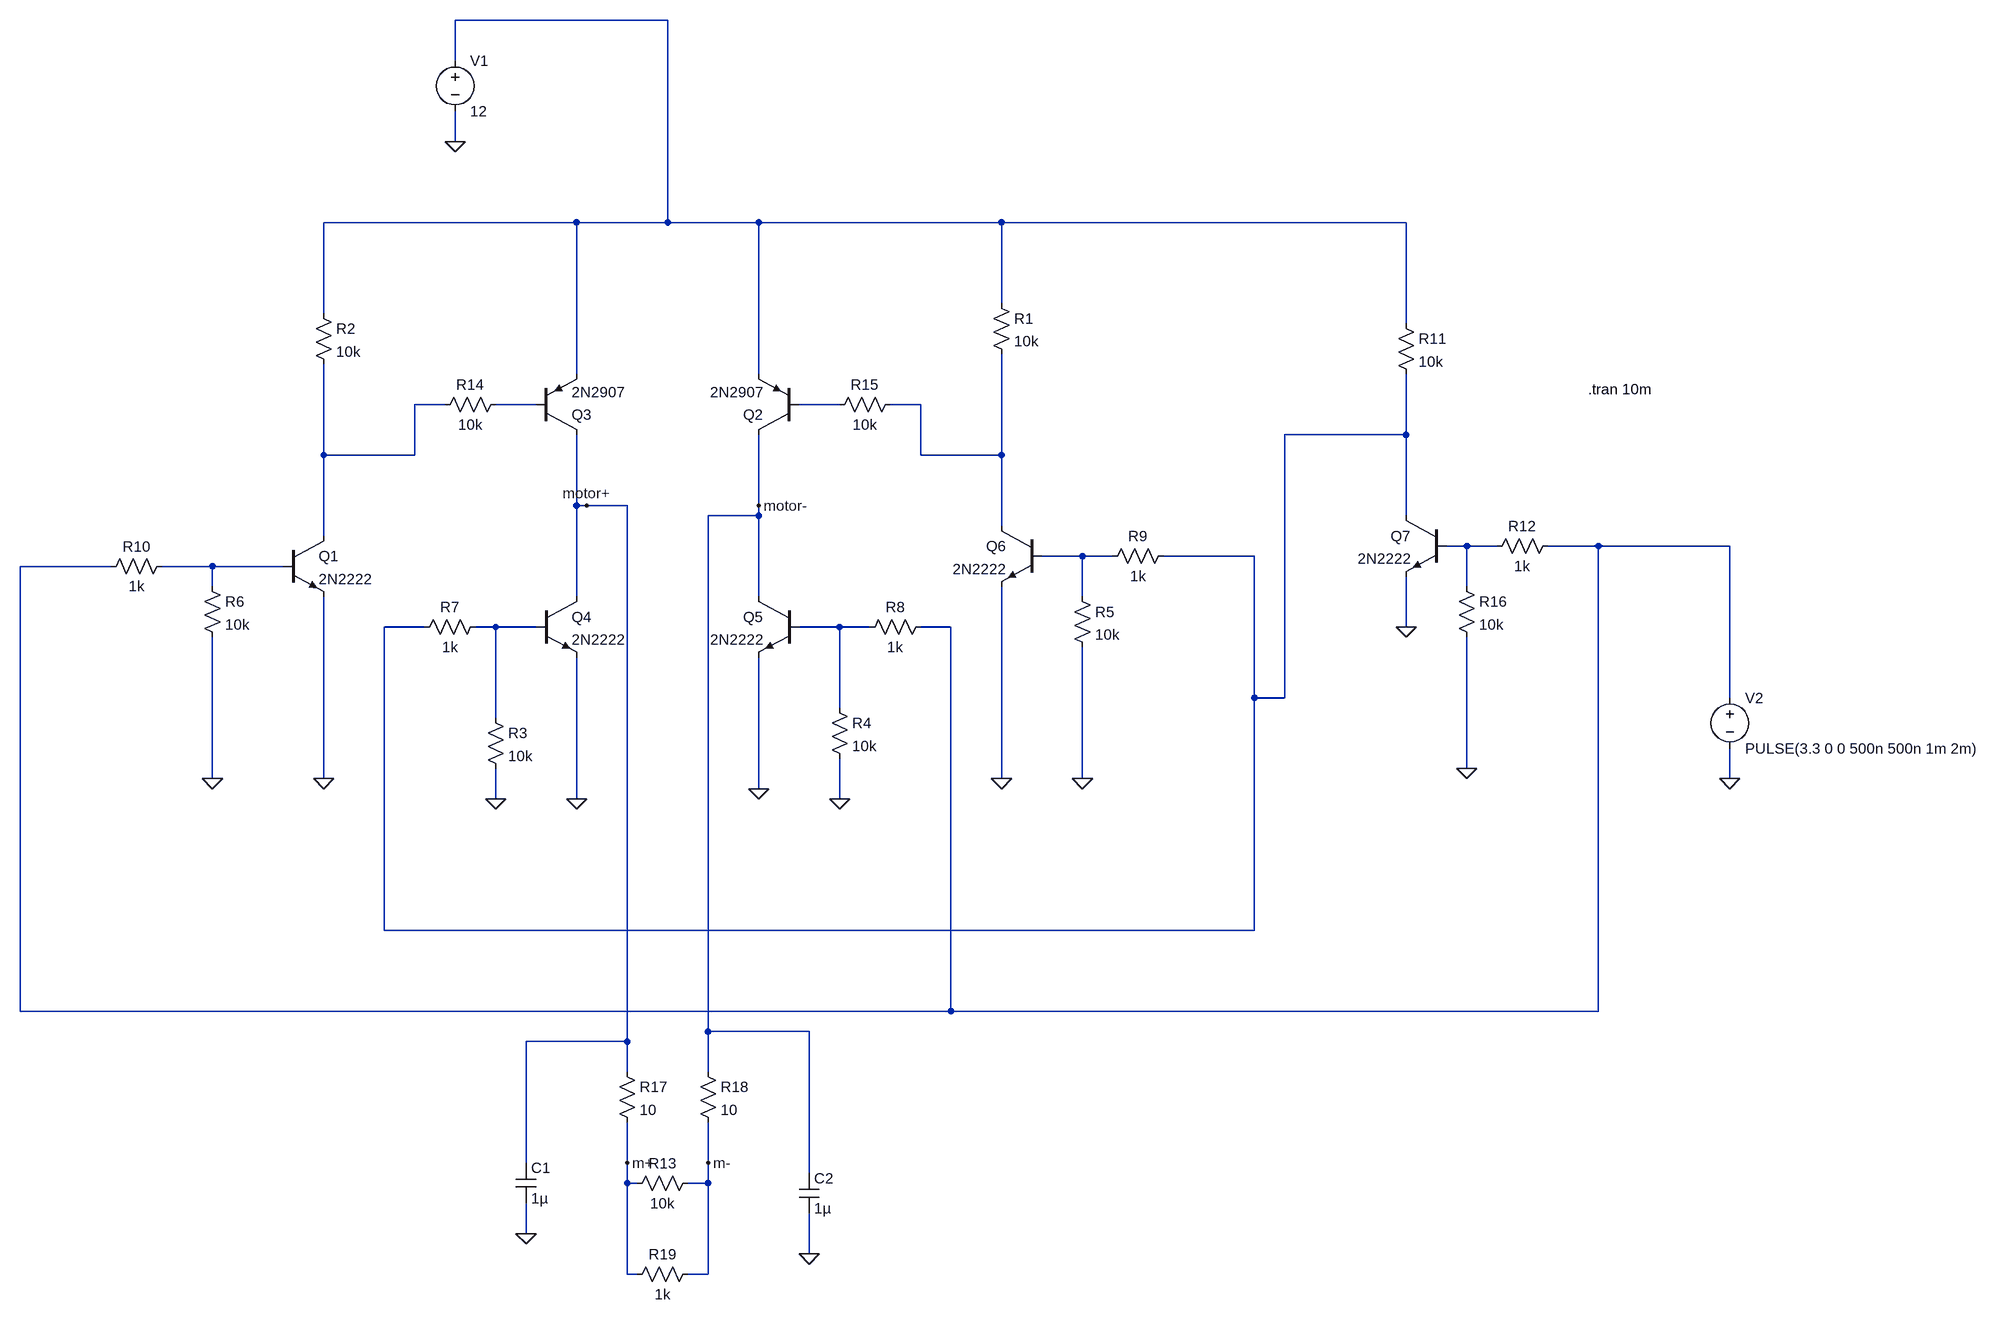
[diagram p0: schematic StallMotor.asc]
StallMotor.asc, the LTspice schematic file:
Version 4
SHEET 1 2340 1592
WIRE 256 -432 -80 -432
WIRE -80 -368 -80 -432
WIRE -80 -240 -80 -288
WIRE 112 -112 -288 -112
WIRE 256 -112 256 -432
WIRE 256 -112 112 -112
WIRE 400 -112 256 -112
WIRE 784 -112 400 -112
WIRE 1424 -112 784 -112
WIRE 784 16 784 -112
WIRE -288 32 -288 -112
WIRE 1424 48 1424 -112
WIRE 112 128 112 -112
WIRE 400 128 400 -112
WIRE -96 176 -144 176
WIRE 48 176 -16 176
WIRE 528 176 464 176
WIRE 656 176 608 176
WIRE 1424 224 1424 128
WIRE 1424 224 1232 224
WIRE -288 256 -288 112
WIRE -144 256 -144 176
WIRE -144 256 -288 256
WIRE 656 256 656 176
WIRE 784 256 784 96
WIRE 784 256 656 256
WIRE 112 336 112 224
WIRE 128 336 112 336
WIRE 192 336 128 336
WIRE 400 336 400 224
WIRE 400 352 400 336
WIRE 400 352 320 352
WIRE 1424 352 1424 224
WIRE 784 368 784 256
WIRE -288 384 -288 256
WIRE 1520 400 1488 400
WIRE 1568 400 1520 400
WIRE 1728 400 1648 400
WIRE 1936 400 1728 400
WIRE 912 416 848 416
WIRE 960 416 912 416
WIRE 1184 416 1040 416
WIRE -624 432 -768 432
WIRE -464 432 -544 432
WIRE -352 432 -464 432
WIRE -464 464 -464 432
WIRE 1520 464 1520 400
WIRE 112 480 112 336
WIRE 400 480 400 352
WIRE 912 480 912 416
WIRE -128 528 -192 528
WIRE -16 528 -48 528
WIRE 48 528 -16 528
WIRE 528 528 464 528
WIRE 576 528 528 528
WIRE 704 528 656 528
WIRE 1424 528 1424 448
WIRE 1184 640 1184 416
WIRE 1232 640 1232 224
WIRE 1232 640 1184 640
WIRE 1936 640 1936 400
WIRE 528 656 528 528
WIRE -16 672 -16 528
WIRE 1520 752 1520 544
WIRE -464 768 -464 544
WIRE -288 768 -288 480
WIRE 784 768 784 464
WIRE 912 768 912 560
WIRE 1936 768 1936 720
WIRE 400 784 400 576
WIRE -16 800 -16 752
WIRE 112 800 112 576
WIRE 528 800 528 736
WIRE -192 1008 -192 528
WIRE 1184 1008 1184 640
WIRE 1184 1008 -192 1008
WIRE -768 1136 -768 432
WIRE 704 1136 704 528
WIRE 704 1136 -768 1136
WIRE 1728 1136 1728 400
WIRE 1728 1136 704 1136
WIRE 320 1168 320 352
WIRE 480 1168 320 1168
WIRE 192 1184 192 336
WIRE 192 1184 32 1184
WIRE 192 1232 192 1184
WIRE 320 1232 320 1168
WIRE 32 1376 32 1184
WIRE 192 1376 192 1312
WIRE 320 1376 320 1312
WIRE 480 1392 480 1168
WIRE 192 1408 192 1376
WIRE 208 1408 192 1408
WIRE 320 1408 320 1376
WIRE 320 1408 288 1408
WIRE 32 1488 32 1440
WIRE 480 1520 480 1456
WIRE 192 1552 192 1408
WIRE 208 1552 192 1552
WIRE 320 1552 320 1408
WIRE 320 1552 288 1552
FLAG -288 768 0
FLAG 784 768 0
FLAG 912 768 0
FLAG -464 768 0
FLAG -16 800 0
FLAG 528 800 0
FLAG 112 800 0
FLAG 400 784 0
FLAG -80 -240 0
FLAG 1424 528 0
FLAG 1936 768 0
FLAG 128 336 motor+
FLAG 400 336 motor-
FLAG 1520 752 0
FLAG 192 1376 m+
FLAG 320 1376 m-
FLAG 32 1488 0
FLAG 480 1520 0
SYMBOL npn -352 384 R0
SYMATTR InstName Q1
SYMATTR Value 2N2222
SYMBOL pnp 464 224 R180
SYMATTR InstName Q2
SYMATTR Value 2N2907
SYMBOL pnp 48 224 M180
SYMATTR InstName Q3
SYMATTR Value 2N2907
SYMBOL npn 48 480 R0
SYMATTR InstName Q4
SYMATTR Value 2N2222
SYMBOL npn 464 480 M0
SYMATTR InstName Q5
SYMATTR Value 2N2222
SYMBOL npn 848 368 M0
SYMATTR InstName Q6
SYMATTR Value 2N2222
SYMBOL Res 768 0 R0
SYMATTR InstName R1
SYMATTR Value 10k
SYMBOL Res -304 16 R0
SYMATTR InstName R2
SYMATTR Value 10k
SYMBOL Res -32 656 R0
SYMATTR InstName R3
SYMATTR Value 10k
SYMBOL Res 512 640 R0
SYMATTR InstName R4
SYMATTR Value 10k
SYMBOL Res 896 464 R0
SYMATTR InstName R5
SYMATTR Value 10k
SYMBOL Res -480 448 R0
SYMATTR InstName R6
SYMATTR Value 10k
SYMBOL Res -32 512 R90
WINDOW 0 0 56 VBottom 2
WINDOW 3 32 56 VTop 2
SYMATTR InstName R7
SYMATTR Value 1k
SYMBOL Res 672 512 R90
WINDOW 0 0 56 VBottom 2
WINDOW 3 32 56 VTop 2
SYMATTR InstName R8
SYMATTR Value 1k
SYMBOL Res 1056 400 R90
WINDOW 0 0 56 VBottom 2
WINDOW 3 32 56 VTop 2
SYMATTR InstName R9
SYMATTR Value 1k
SYMBOL Res -528 416 R90
WINDOW 0 0 56 VBottom 2
WINDOW 3 32 56 VTop 2
SYMATTR InstName R10
SYMATTR Value 1k
SYMBOL voltage -80 -384 R0
SYMATTR InstName V1
SYMATTR Value 12
SYMBOL npn 1488 352 M0
SYMATTR InstName Q7
SYMATTR Value 2N2222
SYMBOL Res 1408 32 R0
SYMATTR InstName R11
SYMATTR Value 10k
SYMBOL Res 1664 384 R90
WINDOW 0 0 56 VBottom 2
WINDOW 3 32 56 VTop 2
SYMATTR InstName R12
SYMATTR Value 1k
SYMBOL voltage 1936 624 R0
SYMATTR InstName V2
SYMATTR Value PULSE(3.3 0 0 500n 500n 1m 2m)
SYMBOL Res 304 1392 R90
WINDOW 0 0 56 VBottom 2
WINDOW 3 32 56 VTop 2
SYMATTR InstName R13
SYMATTR Value 10k
SYMBOL Res 0 160 R90
WINDOW 0 0 56 VBottom 2
WINDOW 3 32 56 VTop 2
SYMATTR InstName R14
SYMATTR Value 10k
SYMBOL Res 624 160 R90
WINDOW 0 0 56 VBottom 2
WINDOW 3 32 56 VTop 2
SYMATTR InstName R15
SYMATTR Value 10k
SYMBOL Res 1504 448 R0
SYMATTR InstName R16
SYMATTR Value 10k
SYMBOL Res 176 1216 R0
SYMATTR InstName R17
SYMATTR Value 10
SYMBOL Res 304 1216 R0
SYMATTR InstName R18
SYMATTR Value 10
SYMBOL Res 304 1536 R90
WINDOW 0 0 56 VBottom 2
WINDOW 3 32 56 VTop 2
SYMATTR InstName R19
SYMATTR Value 1k
SYMBOL cap 16 1376 R0
SYMATTR InstName C1
SYMATTR Value 1µ
SYMBOL cap 464 1392 R0
SYMATTR InstName C2
SYMATTR Value 1µ
TEXT 1712 152 Left 2 !.tran 10m

The netlist it stands for:
* StallMotor.asc
Q1 N002 N010 0 0 2N2222
Q2 motor- N004 N001 0 2N2907
Q3 motor+ N003 N001 0 2N2907
Q4 motor+ N011 0 0 2N2222
Q5 motor- N012 0 0 2N2222
Q6 N005 N009 0 0 2N2222
R1 N001 N005 10k
R2 N001 N002 10k
R3 N011 0 10k
R4 N012 0 10k
R5 N009 0 10k
R6 N010 0 10k
R7 N011 N006 1k
R8 N008 N012 1k
R9 N006 N009 1k
R10 N010 N008 1k
V1 N001 0 12
Q7 N006 N007 0 0 2N2222
R11 N001 N006 10k
R12 N008 N007 1k
V2 N008 0 PULSE(3.3 0 0 500n 500n 1m 2m)
R13 m- m+ 10k
R14 N003 N002 10k
R15 N005 N004 10k
R16 N007 0 10k
R17 motor+ m+ 10
R18 motor- m- 10
R19 m- m+ 1k
C1 motor+ 0 1µ
C2 motor- 0 1µ
.model NPN NPN
.model PNP PNP
.lib standard.bjt
.tran 10m
.backanno
.end